# Altium project bottom.PrjPcb
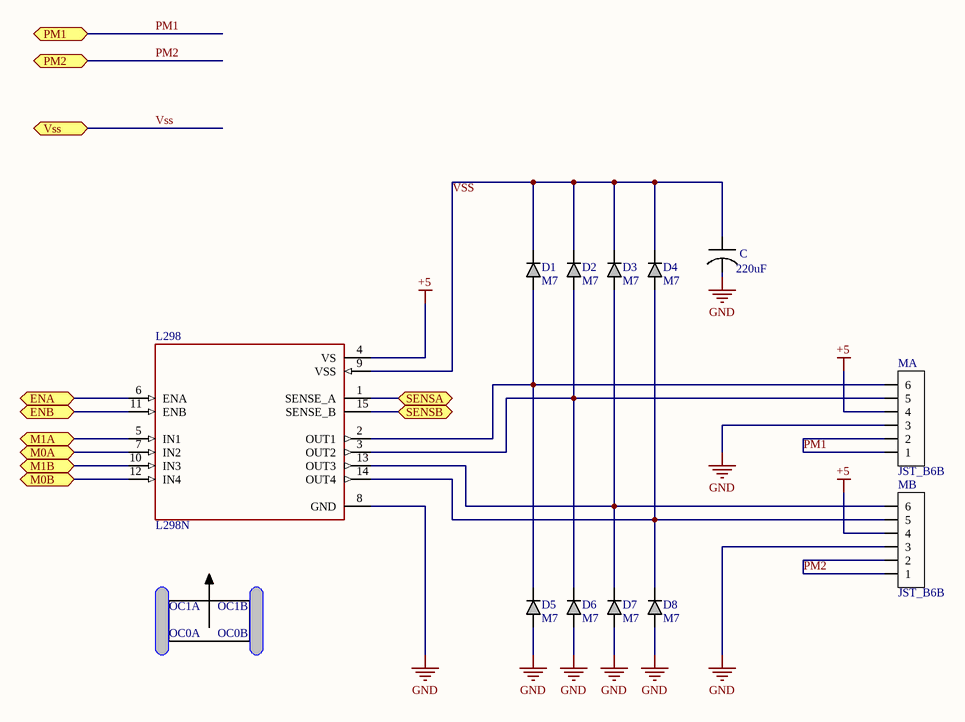
[diagram p0: Motors_Sheet.SchDoc]
4 sheets, 35 parts. Net scope: flat (ports and power ports of the same name join across sheets).
Board file: main_btm.PcbDoc
Sheets:
  Motors_Sheet.SchDoc
  Power_Sheet.SchDoc
  connection_Sheet.SchDoc
  Encoder_Sheet.SchDoc

## Sheet Motors_Sheet.SchDoc
size A

### Parts
C  value 220uF  [CAP_8115]  (hidden comment: cap_elec8115)
D1  M7  [1N4007]
D2  M7  [1N4007]
D3  M7  [1N4007]
D4  M7  [1N4007]
D5  M7  [1N4007]
D6  M7  [1N4007]
D7  M7  [1N4007]
D8  M7  [1N4007]
L298  L298N  [L298N]
MA  JST_B6B  [JST_B6B]
MB  JST_B6B  [JST_B6B]

### Ports
ENA (bidir), ENB (bidir), M0A (bidir), M0B (bidir), M1A (bidir), M1B (bidir), PM1 (bidir), PM2 (bidir), SENSA (bidir), SENSB (bidir), Vss (bidir)

### Nets
+5: L298.4(VS) MA.4 MB.4
GND: C.neg D5.A D6.A D7.A D8.A L298.8(GND) MA.3 MB.3
PM1: MA.1 MA.2 ; port PM1
PM2: MB.1 MB.2 ; port PM2
VSS: C.pos D1.C D2.C D3.C D4.C L298.9(VSS) ; port Vss
NetD1_A: D1.A D5.C L298.2(OUT1) MA.6
NetD2_A: D2.A D6.C L298.3(OUT2) MA.5
NetD3_A: D3.A D7.C L298.13(OUT3) MB.6
NetD4_A: D4.A D8.C L298.14(OUT4) MB.5
Netj4_3: L298.6(ENA) ; port ENA
Netj4_4: L298.11(ENB) ; port ENB
Netj5_1: L298.12(IN4) ; port M0B
Netj6_1: L298.7(IN2) ; port M0A
Netj6_3: L298.5(IN1) ; port M1A
Netj6_4: L298.10(IN3) ; port M1B
Netj7_1: L298.1(SENSE_A) ; port SENSA
Netj7_2: L298.15(SENSE_B) ; port SENSB

### Notes on the sheet
- OC1A
- OC1B
- OC0A
- OC0B

### Library data of the parts
D1-D8 = 1N4007

## Sheet Power_Sheet.SchDoc
size A
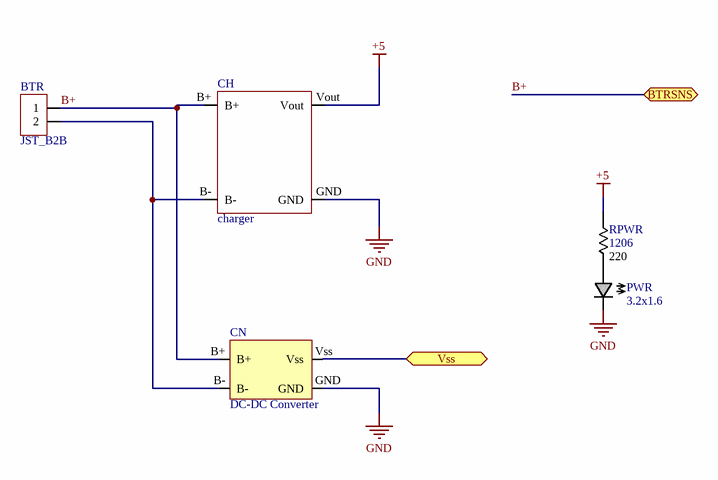
[diagram p1: Power_Sheet.SchDoc]

### Parts
BTR  JST_B2B  [JST_B2B]
CH  charger  [1S_Charger]
CN  DC-DC Converter  [DC-DC Conv]
PWR  3.2x1.6  [LED3_2X1_6]
RPWR  1206  value 220  [1206]

### Ports
BTRSNS (bidir), Vss (bidir)

### Nets
+5: CH.Vout RPWR.2
GND: CH.GND CN.GND PWR.C
B+: BTR.1 CH.B+ CN.B+ ; port BTRSNS
VSS: CN.Vss ; port Vss
NetBTR_2: BTR.2 CH.B- CN.B-
NetPWR_A: PWR.A RPWR.1

### Library data of the parts
CN = DC-DC Converter: pin to pad: GND>Vout- Vss>Vout+
PWR = led

## Sheet connection_Sheet.SchDoc
size A
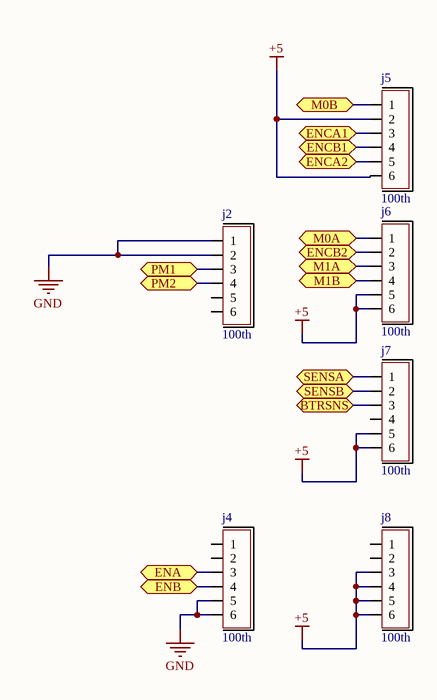
[diagram p2: connection_Sheet.SchDoc]

### Parts
j2  100th  [pin6header]
j4  100th  [pin6header]
j5  100th  [pin6header]
j6  100th  [pin6header]
j7  100th  [pin6header]
j8  100th  [pin6header]

### Ports
BTRSNS (bidir), ENA (bidir), ENB (bidir), ENCA1 (bidir), ENCA2 (bidir), ENCB1 (bidir), ENCB2 (bidir), M0A (bidir), M0B (bidir), M1A (bidir), M1B (bidir), PM1 (bidir), PM2 (bidir), SENSA (bidir), SENSB (bidir)

### Nets
+5: j5.2 j5.6 j6.5 j6.6 j7.5 j7.6 j8.3 j8.4 j8.5 j8.6
GND: j2.1 j2.2 j4.5 j4.6
B+: j7.3 ; port BTRSNS
PM1: j2.3 ; port PM1
PM2: j2.4 ; port PM2
NetE1_4: j5.3 ; port ENCA1
NetE2_4: j5.5 ; port ENCA2
NetE3_4: j5.4 ; port ENCB1
NetE4_4: j6.2 ; port ENCB2
Netj4_3: j4.3 ; port ENA
Netj4_4: j4.4 ; port ENB
Netj5_1: j5.1 ; port M0B
Netj6_1: j6.1 ; port M0A
Netj6_3: j6.3 ; port M1A
Netj6_4: j6.4 ; port M1B
Netj7_1: j7.1 ; port SENSA
Netj7_2: j7.2 ; port SENSB

Not connected (* = marked no-connect by the designer): j2 5 6; j4 1 2; j7 4; j8 1 2

### Library data of the parts
j2 j4-j8 = pin6header: System: Connector

## Sheet Encoder_Sheet.SchDoc
size A
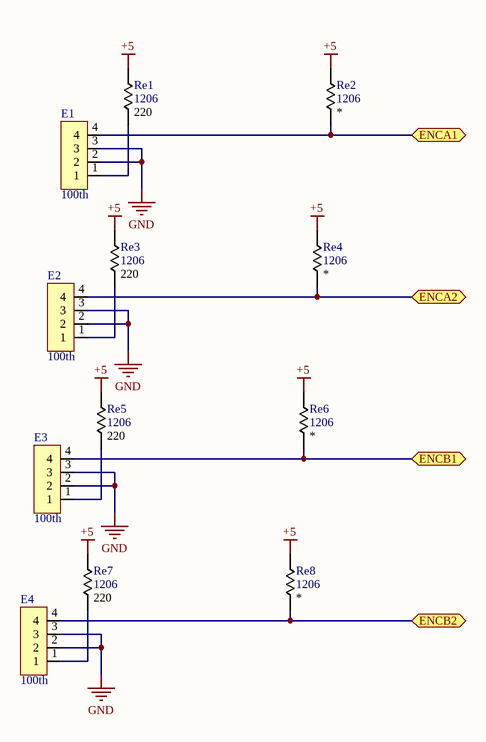
[diagram p3: Encoder_Sheet.SchDoc]

### Parts
E1  100th  [pin4header]
E2  100th  [pin4header]
E3  100th  [pin4header]
E4  100th  [pin4header]
Re1  1206  value 220  [1206]
Re2  1206  [1206]
Re3  1206  value 220  [1206]
Re4  1206  [1206]
Re5  1206  value 220  [1206]
Re6  1206  [1206]
Re7  1206  value 220  [1206]
Re8  1206  [1206]

### Ports
ENCA1 (bidir), ENCA2 (bidir), ENCB1 (bidir), ENCB2 (bidir)

### Nets
+5: Re1.2 Re2.2 Re3.2 Re4.2 Re5.2 Re6.2 Re7.2 Re8.2
GND: E1.2 E1.3 E2.2 E2.3 E3.2 E3.3 E4.2 E4.3
NetE1_1: E1.1 Re1.1
NetE1_4: E1.4 Re2.1 ; port ENCA1
NetE2_1: E2.1 Re3.1
NetE2_4: E2.4 Re4.1 ; port ENCA2
NetE3_1: E3.1 Re5.1
NetE3_4: E3.4 Re6.1 ; port ENCB1
NetE4_1: E4.1 Re7.1
NetE4_4: E4.4 Re8.1 ; port ENCB2

### Library data of the parts
E1-E4 = Pin4Header
Re1-Re8 = 1206
  Re2 Re4 Re6 Re8: Value: *

## Nets that join several sheets
+5: Motors_Sheet (L298.4 MA.4 MB.4), Power_Sheet (CH.Vout RPWR.2), connection_Sheet (10 pins), Encoder_Sheet (8 pins)
GND: Motors_Sheet (8 pins), Power_Sheet (CH.GND CN.GND PWR.C), connection_Sheet (j2.1 j2.2 j4.5 j4.6), Encoder_Sheet (8 pins)
B+: Power_Sheet (BTR.1 CH.B+ CN.B+), connection_Sheet (j7.3)
NetE1_4: connection_Sheet (j5.3), Encoder_Sheet (E1.4 Re2.1)
NetE2_4: connection_Sheet (j5.5), Encoder_Sheet (E2.4 Re4.1)
NetE3_4: connection_Sheet (j5.4), Encoder_Sheet (E3.4 Re6.1)
NetE4_4: connection_Sheet (j6.2), Encoder_Sheet (E4.4 Re8.1)
Netj4_3: Motors_Sheet (L298.6), connection_Sheet (j4.3)
Netj4_4: Motors_Sheet (L298.11), connection_Sheet (j4.4)
Netj5_1: Motors_Sheet (L298.12), connection_Sheet (j5.1)
Netj6_1: Motors_Sheet (L298.7), connection_Sheet (j6.1)
Netj6_3: Motors_Sheet (L298.5), connection_Sheet (j6.3)
Netj6_4: Motors_Sheet (L298.10), connection_Sheet (j6.4)
Netj7_1: Motors_Sheet (L298.1), connection_Sheet (j7.1)
Netj7_2: Motors_Sheet (L298.15), connection_Sheet (j7.2)
PM1: Motors_Sheet (MA.1 MA.2), connection_Sheet (j2.3)
PM2: Motors_Sheet (MB.1 MB.2), connection_Sheet (j2.4)
VSS: Motors_Sheet (6 pins), Power_Sheet (CN.Vss)